# Altium project XC7A35.PrjPcb (part 4 of 5)

## Sheet SERIALIZER.SchDoc: XC7A3G-SERIALIZER
size A4; Date: 9 AUG 2026; Engineer: Parsa Malekpour; Revision: 1.0.0; SheetNumber: 15; SheetTotal: 18
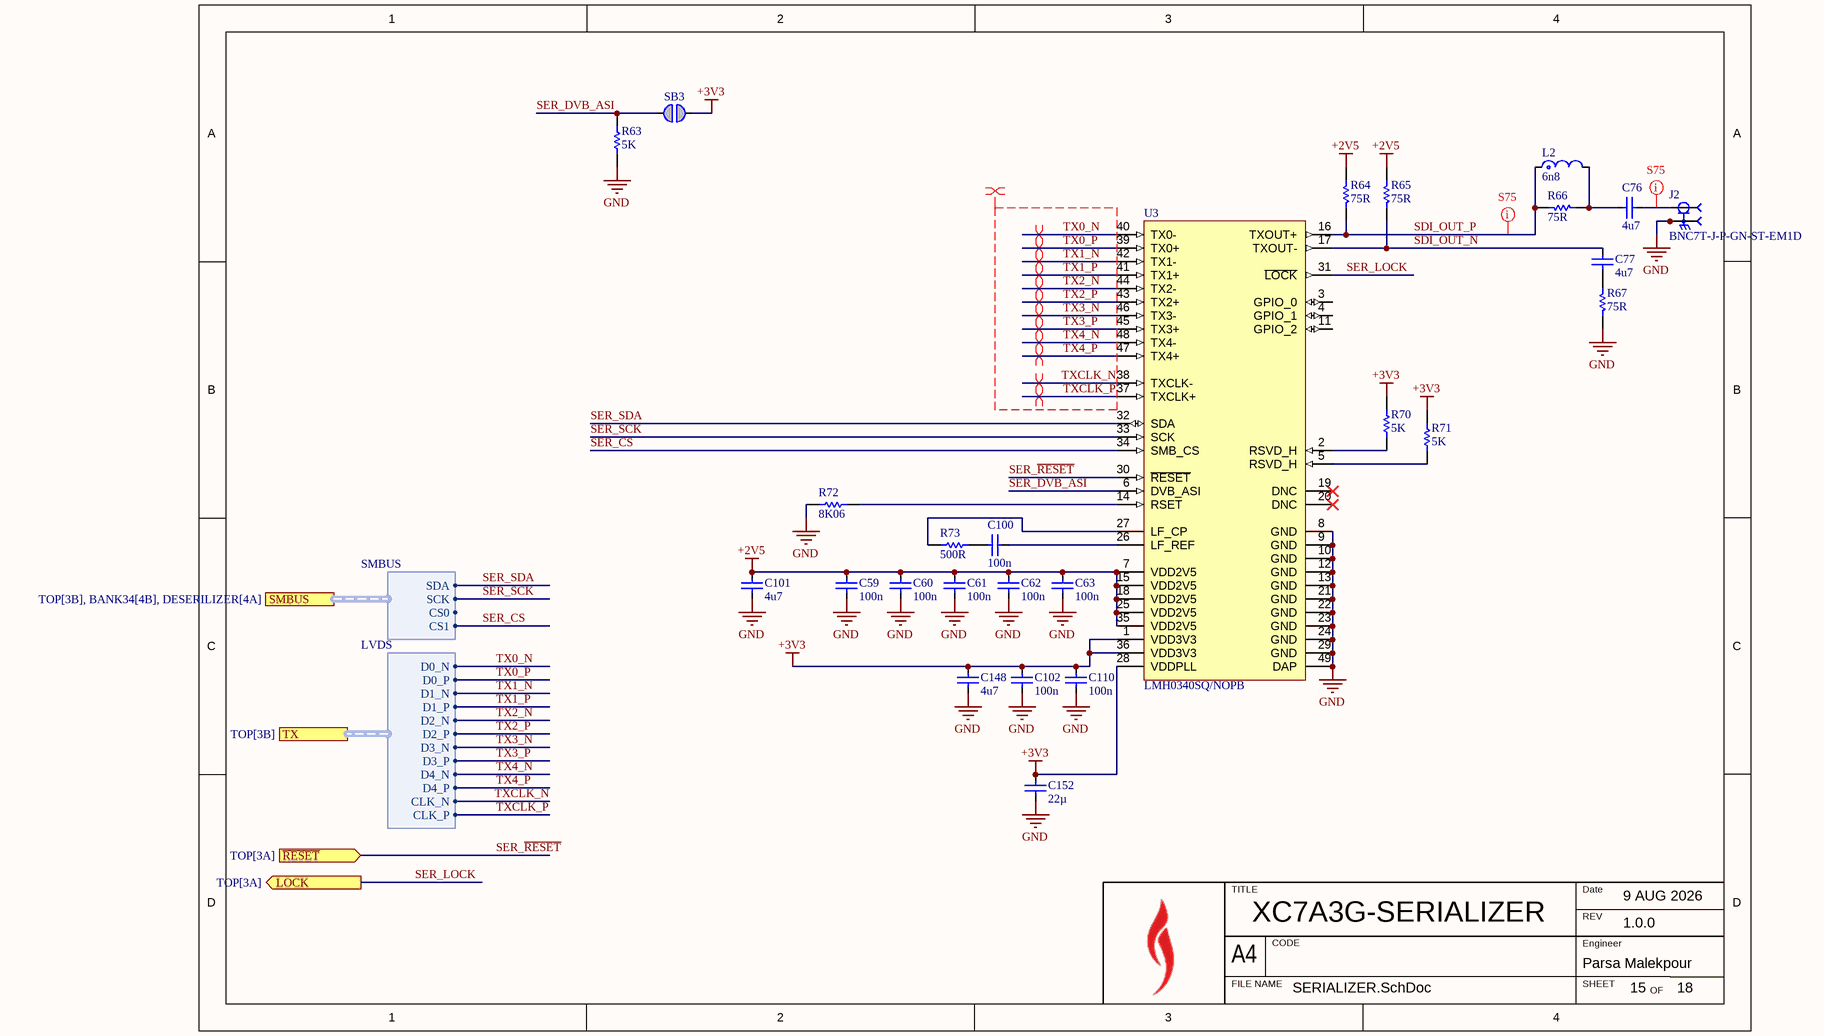
[diagram p10: SERIALIZER.SchDoc]

### Parts
C59  value 100n  [FP-C1005-050-0_05-IPC_C]  (hidden comment: C1005X7R1H104K050BB)
C60  value 100n  [FP-C1005-050-0_05-IPC_C]  (hidden comment: C1005X7R1H104K050BB)
C61  value 100n  [FP-C1005-050-0_05-IPC_C]  (hidden comment: C1005X7R1H104K050BB)
C62  value 100n  [FP-C1005-050-0_05-IPC_C]  (hidden comment: C1005X7R1H104K050BB)
C63  value 100n  [FP-C1005-050-0_05-IPC_C]  (hidden comment: C1005X7R1H104K050BB)
C76  value 4u7  [FP-C1005-050-0_20-0_10-IPC_C]  (hidden comment: C1005X5R1A475K050BE)
C77  value 4u7  [FP-C1005-050-0_20-0_10-IPC_C]  (hidden comment: C1005X5R1A475K050BE)
C100  value 100n  [FP-C1005-050-0_05-IPC_C]  (hidden comment: C1005X7R1H104K050BB)
C101  value 4u7  [FP-C1005-050-0_20-0_10-IPC_C]  (hidden comment: C1005X5R1A475K050BE)
C102  value 100n  [FP-C1005-050-0_05-IPC_C]  (hidden comment: C1005X7R1H104K050BB)
C110  value 100n  [FP-C1005-050-0_05-IPC_C]  (hidden comment: C1005X7R1H104K050BB)
C148  value 4u7  [FP-C1005-050-0_20-0_10-IPC_C]  (hidden comment: C1005X5R1A475K050BE)
C152  value 22µ  [CAPC1608X100X20LL10]  (hidden comment: C1608X5R0J226M080AC)
J2  BNC7T-J-P-GN-ST-EM1D  [SAMTEC_BNC7T-J-P-XX-ST-EM1D]
L2  value 6n8  [FP-LQP03TG_02-MFG]  (hidden comment: LQP03TN6N8J02D)
R63  value 5K  [RESC1005X40X25NL05T10]  (hidden comment: RC0402FR-075KL)
R64  value 75R  [RESC1005X40X25LL05T10]  (hidden comment: RC0402FR-0775RL)
R65  value 75R  [RESC1005X40X25LL05T10]  (hidden comment: RC0402FR-0775RL)
R66  value 75R  [RESC1005X40X25LL05T10]  (hidden comment: RC0402FR-0775RL)
R67  value 75R  [RESC1005X40X25LL05T10]  (hidden comment: RC0402FR-0775RL)
R70  value 5K  [RESC1005X40X25NL05T10]  (hidden comment: RC0402FR-075KL)
R71  value 5K  [RESC1005X40X25NL05T10]  (hidden comment: RC0402FR-075KL)
R72  value 8K06  [RESC1005X40X25LL05T10]  (hidden comment: RC0402FR-078K06L)
R73  value 500R  [RESC1005X40X25NL05T10]  (hidden comment: RT0402FRE07500RL)
SB3  Solderbridge  [Solderbridge]  (value not drawn)  (no BOM)
U3  LMH0340SQ/NOPB  [RHS0048A_V]

### Ports
LOCK (out, see TOP[3A]), SMBUS (harness SMBUS, see TOP[3B], BANK34[4B], DESERILIZER[4A]), TX (harness LVDS, see TOP[3B]), ~{RESET} (in, see TOP[3A])

### Harnesses
LVDS: D0_N, D0_P, D1_N, D1_P, D2_N, D2_P, D3_N, D3_P, D4_N, D4_P, CLK_N, CLK_P
SMBUS: SDA, SCK, CS0, CS1

### Nets
+2V5: C59.1 C60.1 C61.1 C62.1 C63.1 C101.2 R64.2 R65.2 U3.7(VDD2V5) U3.15(VDD2V5) U3.18(VDD2V5) U3.25(VDD2V5) U3.35(VDD2V5)
+3V3: C102.1 C110.1 C148.1 C152.1 R70.1 R71.1 SB3.1 U3.1(VDD3V3) U3.28(VDDPLL) U3.36(VDD3V3)
GND: C59.2 C60.2 C61.2 C62.2 C63.2 C101.1 C102.2 C110.2 C148.2 C152.2 J2.S1 J2.S2 J2.S3 J2.S4 R63.2 R67.2 R72.1 U3.8(GND) U3.9(GND) U3.10(GND) U3.12(GND) U3.13(GND) U3.21(GND) U3.22(GND) U3.23(GND) U3.24(GND) U3.29(GND) U3.49(DAP)
SDI_OUT_N: C77.2 R65.1 U3.17(TXOUT-)
SDI_OUT_P: L2.1 R64.1 R66.1 U3.16(TXOUT+)
SER_CS: U3.34(SMB_CS) ; port SMBUS.CS1
SER_DVB_ASI: R63.1 SB3.2 U3.6(DVB_ASI)
SER_LOCK: U3.31(~{LOCK}) ; port LOCK
SER_~{RESET}: U3.30(~{RESET}) ; port ~{RESET}
SER_SCK: U3.33(SCK) ; port SMBUS.SCK  [project net DES_SCK]
SER_SDA: U3.32(SDA) ; port SMBUS.SDA  [project net DES_SDA]
TX0_N: U3.40(TX0-) ; port TX.D0_N  [project net B34_L10_N]
TX0_P: U3.39(TX0+) ; port TX.D0_P  [project net B34_L10_P]
TX1_N: U3.42(TX1-) ; port TX.D1_N  [project net B34_L12_N]
TX1_P: U3.41(TX1+) ; port TX.D1_P  [project net B34_L12_P]
TX2_N: U3.44(TX2-) ; port TX.D2_N  [project net B34_L8_N]
TX2_P: U3.43(TX2+) ; port TX.D2_P  [project net B34_L8_P]
TX3_N: U3.46(TX3-) ; port TX.D3_N  [project net B34_L11_N]
TX3_P: U3.45(TX3+) ; port TX.D3_P  [project net B34_L11_P]
TX4_N: U3.48(TX4-) ; port TX.D4_N  [project net B34_L7_N]
TX4_P: U3.47(TX4+) ; port TX.D4_P  [project net B34_L7_P]
TXCLK_N: U3.38(TXCLK-) ; port TX.CLK_N  [project net B34_L9_N]
TXCLK_P: U3.37(TXCLK+) ; port TX.CLK_P  [project net B34_L9_P]
NetC76_1: C76.1 L2.2 R66.2
NetC76_2: C76.2 J2.1
NetC77_1: C77.1 R67.1
NetC100_1: C100.1 R73.2
NetC100_2: C100.2 U3.26(LF_REF)
NetR70_2: R70.2 U3.2(RSVD_H)
NetR71_2: R71.2 U3.5(RSVD_H)
NetR72_2: R72.2 U3.14(RSET)
NetR73_1: R73.1 U3.27(LF_CP)

Not connected (* = marked no-connect by the designer): U3 3(GPIO_0) 4(GPIO_1) 11(GPIO_2) 19(DNC)* 20(DNC)*

### Layout directives
differential pair: B34_L7_N, B34_L7_P, B34_L8_N, B34_L8_P, B34_L9_N, B34_L9_P, B34_L10_N, B34_L10_P, B34_L11_N, B34_L11_P, B34_L12_N, B34_L12_P
net class LVDS_TX: TX0_N, TX0_P, TX1_N, TX1_P, TX2_N, TX2_P, TX3_N, TX3_P, TX4_N, TX4_P, TXCLK_N, TXCLK_P
rule Impedance Constraint [Min = 70.00    Max = 80.00    ]: NetC76_2, SDI_OUT_P

### Notes on the sheet
- TITLE
- REV
- Date
- A4
- FILE NAME
- CODE
- SHEET
- Engineer
- OF

### Library data of the parts
C59-C63 C100 C102 C110 = C1005X7R1H104K050BB: MLCC 100nF ±10% 50V X7R SMD 0402; Dielectric Material: Ceramic; Voltage: 50V; Min Operating Temperature: -55°C; Depth: 0.5mm; Radiation Hardening: No; RoHS Compliant: Yes; Voltage Rating (DC): 50V; Lead Free: Lead Free; Resistor Type: Ceramic; Height: 0.5mm; Dielectric: X7R; Thickness: 0.022inch; Case/Package: 0402; Case Code (Metric): 1005; Termination: SMD/SMT; Packaging: Tape and Reel; Max Operating Temperature: 125°C; Mount: Surface Mount; Package Quantity: 1; Width: 0.02inch; Weight: 2.3E-05oz; Voltage Rating: 50V; Tolerance: 10%; Construction: Flat; Case Code (Imperial): 0402; Length: 1mm; REACH SVHC: No SVHC; Series: C; Part Number: C1005X7R1H104K050BB
C76 C77 C101 C148 = C1005X5R1A475K050BE: 4.7UF 10V X5R 0402; Tolerance: 10%; Max Operating Temperature: 85°C; Case Code (Metric): 1005; Voltage Rating: 10V; Packaging: Tape and Reel; Case/Package: 0402; Features: Soft Termination; Min Operating Temperature: -55°C; Mount: Surface Mount; Case Code (Imperial): 0402; RoHS Compliant: Yes; Part Number: C1005X5R1A475K050BE
C152 = C1608X5R0J226M080AC: MLCC 22 uF, ±20%, 6.3 V, -55 to 85 degC, 1608 (0603 Metric), RoHS, Tape and Reel; PCN Part Number: MLCCPartNumberChange30/Nov/2012; Manufacturer: TDK; Temperature Coefficient: X5R; Product Training Modules: CSeriesGeneralApplicationsSEAT,CCV,andTVCLDesignToolsGuidetoReplacinganElectrolyticCapacitorwithanMLCC; Other Names: 445-8028-1; Voltage - Rated: 6.3V; Design Resources: 20WNon-IsolatedBuckLEDDriverUsingPLLNK460KG; Online Catalog: CSeries,GeneralPurpose; Kits: 445-9003-KIT-ND-KITCAPCERHICAPMLCCSMD; Tolerance: ±20%; Series: C; Thickness (Max): 0.039"(1.00mm); Mounting Type: SurfaceMount,MLCC; Ratings: -; Datasheet Version: Mar-15; Package Reference: 603; Packaging: CutTape(CT); Features: -; Package / Case: 0603(1608Metric); Family: CeramicCapacitors; Lead Spacing: -; RoHS Information: RoHSCertificate-MLCC; Manufacturer URL: http://www.tdk.com/; Lead Style: -; Category: Capacitors; Applications: GeneralPurpose; Package Description: 2-Pin Surface Mount Device, Body 1.6 x 0.8 mm; Standard Package: 1; Datasheet URL: http://www.farnell.com/datasheets/1913358.pdf; Height - Seated (Max): -; Operating Temperature: -55degC~85degC; Size / Dimension: 0.063"Lx0.031"W(1.60mmx0.80mm)
J2 = BNC7T-J-P-GN-ST-EM1D: BNC Connector Jack, Female Socket 75Ohm Board Edge, End Launch; Panel Mount Solder; MF: Samtec Inc.; Package: None; MP: BNC7T-J-P-GN-ST-EM1D; DigiKey-Purchase-URL: https://snapeda.com/shop?store=DigiKey&id=3266999; Price: None; SnapEDA_Link: https://www.snapeda.com/parts/BNC7T-J-P-GN-ST-EM1D/Samtec%20Inc./view-part/3266999/?ref=snap; Toby_UK-Purchase-URL: https://snapeda.com/shop?store=Toby+UK&id=3266999; Value: *; Availability: Unavailable; Supplier 1: DigiKey; Supplier Part Number 1: SAM10916-ND
L2 = LQP03TN6N8J02D: Film type RF Inductor 6.8nH ±5% 300mA 0.6Ω 0201 (0603); DC Resistance (DCR): 600mR; Q Factor: 14; Shielding: Unshielded; Self Resonant Frequency: 3.9GHz; Core Material: Non-Magnetic; Test Frequency: 500MHz; Mount: Surface Mount; Case Code (Metric): 0603; Depth: 0.33mm; DC Current: 300mA; Current Rating: 300mA; Height: 0.3mm; Min Operating Temperature: -55°C; Width: 0.012inch; Height - Seated (Max): 0.013inch; Package Quantity: 15000; Max DC Current: 300mA; Radiation Hardening: No; Resistor Type: Thin Film; Packaging: Tape and Reel; Length: 0.024inch; Case Code (Imperial): 0201; Weight: 6E-06oz; Military Standard: Not; Case/Package: 0201; Termination: SMD/SMT; Max Operating Temperature: 125°C; Tolerance: 5%
R63 R70 R71 = RES: 62.5mW Thick Film Resistors 50V ±100ppm/℃ ±1% 5kΩ 0402 Chip Resistor - Surface Mount ROHS; Manufacturer: Yageo / Phycomp; Manufacturer Part Number: RC0402FR-071KL; Power Rating: 63mW; Temperature Coefficient: 100ppm/°C; Part Number: RC0402FR-075KL; Supplier: Farnell; Supplier Part Number: 2421889; RoHS: Compliant; Category: Chip SMD Resistors; Stock: 6760000; Pricing: 10000=0.464, 50000=0.406, 100000=0.336 (JPY); Case/Package: 0402; Case Code (Imperial): 0402; Case Code (Metric): 0402; China RoHS: Non-Compliant; Composition: Thick Film; Depth: 500µm; Height: 350µm; Lead Free: Lead Free; Length: 1mm; Lifecycle Status: Production; Max Operating Temperature: 155°C; Military Standard: Not; Min Operating Temperature: -55°C; Mounting Technology: Surface Mount; Pins: 2; Number of Terminals: 2; Packaging: Tape & Reel; Power Dissipation: 62.5mW; REACH SVHC: Yes; Schedule B: 8533210045, 8533210045|8533210045|8533210045|8533210045|8533210045|8533210045|8533210045|8533210045|8533210045|8533210045|8533210045|8533210045|8533210045|8533210045|8533210045|8533210045|8533210045|8533210045|8533210045|8533210045|8533210045|8533210045|8533210045|85; Termination: SMD/SMT; Tolerance: 1%; Voltage Rating: 50V; Voltage Rating (AC): 50V; Voltage Rating (DC): 50V; Width: 500µm; Working Voltage: 50V; ComponentLink1URL: https://datasheet.octopart.com:443/RC0402FR-071KL-Yageo-datasheet-175887523.pdf?src-supplier=IHS; ComponentLink1Description: https://datasheet.octopart.com:443/RC0402FR-071KL-Yageo-datasheet-175887523.pdf?src-supplier=IHS; ComponentLink2URL: https://datasheet.octopart.com:443/RC0402FR-071KL-Yageo-datasheet-164759695.pdf?src-supplier=Upverter; ComponentLink2Description: https://datasheet.octopart.com:443/RC0402FR-071KL-Yageo-datasheet-164759695.pdf?src-supplier=Upverter; ComponentLink3URL: https://datasheet.octopart.com:443/RC0402FR-071KL-Yageo-datasheet-103092701.pdf?src-supplier=Upverter; ComponentLink3Description: https://datasheet.octopart.com:443/RC0402FR-071KL-Yageo-datasheet-103092701.pdf?src-supplier=Upverter; ComponentLink4URL: https://sigma.octopart.com:443/138820526/technical_drawing/Yageo-RC0402FR-071KL.pdf?src-supplier=Upverter; ComponentLink4Description: https://sigma.octopart.com:443/138820526/technical_drawing/Yageo-RC0402FR-071KL.pdf?src-supplier=Upverter; ComponentLink5URL: https://datasheet.octopart.com:443/RC0402FR-071KL-Yageo-datasheet-98239111.pdf?src-supplier=Upverter; ComponentLink5Description: https://datasheet.octopart.com:443/RC0402FR-071KL-Yageo-datasheet-98239111.pdf?src-supplier=Upverter; ComponentLink6URL: https://datasheet.octopart.com:443/RC0402FR-071KL-Yageo-Group-datasheet-190305687.pdf?src-supplier=Future+Electronics; ComponentLink6Description: https://datasheet.octopart.com:443/RC0402FR-071KL-Yageo-Group-datasheet-190305687.pdf?src-supplier=Future+Electronics; ComponentLink7URL: https://datasheet.octopart.com:443/RC0402FR-071KL-Yageo-datasheet-12531192.pdf?src-supplier=Future+Electronics; ComponentLink7Description: https://datasheet.octopart.com:443/RC0402FR-071KL-Yageo-datasheet-12531192.pdf?src-supplier=Future+Electronics; ComponentLink8URL: https://datasheet.octopart.com:443/RC0402FR-071KL-Yageo-datasheet-137700087.pdf?src-supplier=Future+Electronics; ComponentLink8Description: https://datasheet.octopart.com:443/RC0402FR-071KL-Yageo-datasheet-137700087.pdf?src-supplier=Future+Electronics; ComponentLink9URL: https://datasheet.octopart.com:443/RC0402FR-071KL-Yageo-datasheet-8324255.pdf?src-supplier=Future+Electronics; ComponentLink9Description: https://datasheet.octopart.com:443/RC0402FR-071KL-Yageo-datasheet-8324255.pdf?src-supplier=Future+Electronics; ComponentLink10URL: https://datasheet.octopart.com:443/RC0402FR-071KL-Yageo-datasheet-10408619.pdf?src-supplier=Newark; ComponentLink10Description: https://datasheet.octopart.com:443/RC0402FR-071KL-Yageo-datasheet-10408619.pdf?src-supplier=Newark; ComponentLink11URL: https://datasheet.octopart.com:443/RC0402FR-071KL-Yageo-datasheet-8324527.pdf?src-supplier=Newark; ComponentLink11Description: https://datasheet.octopart.com:443/RC0402FR-071KL-Yageo-datasheet-8324527.pdf?src-supplier=Newark; ComponentLink12URL: https://datasheet.octopart.com:443/RC0402FR-071KL-Yageo-datasheet-62067350.pdf?src-supplier=Farnell; ComponentLink12Description: https://datasheet.octopart.com:443/RC0402FR-071KL-Yageo-datasheet-62067350.pdf?src-supplier=Farnell; ComponentLink13URL: https://datasheet.octopart.com:443/RC0402FR-071KL-Yageo-datasheet-8329306.pdf?src-supplier=element14; ComponentLink13Description: https://datasheet.octopart.com:443/RC0402FR-071KL-Yageo-datasheet-8329306.pdf?src-supplier=element14; ComponentLink14URL: https://datasheet.octopart.com:443/RC0402FR-071KL-Yageo-datasheet-505231.pdf?src-supplier=element14; ComponentLink14Description: https://datasheet.octopart.com:443/RC0402FR-071KL-Yageo-datasheet-505231.pdf?src-supplier=element14; ComponentLink15URL: https://datasheet.octopart.com:443/RC0402FR-071KL-Yageo-datasheet-175423674.pdf?src-supplier=SOS+electronic; ComponentLink15Description: https://datasheet.octopart.com:443/RC0402FR-071KL-Yageo-datasheet-175423674.pdf?src-supplier=SOS+electronic; ComponentLink16URL: https://datasheet.octopart.com:443/RC0402FR-071KL-Yageo-datasheet-148775077.pdf?src-supplier=TME; ComponentLink16Description: https://datasheet.octopart.com:443/RC0402FR-071KL-Yageo-datasheet-148775077.pdf?src-supplier=TME; ComponentLink17URL: https://datasheet.octopart.com:443/RC0402FR-071KL-Yageo-datasheet-79472498.pdf?src-supplier=Megastar; ComponentLink17Description: https://datasheet.octopart.com:443/RC0402FR-071KL-Yageo-datasheet-79472498.pdf?src-supplier=Megastar; ComponentLink18URL: https://datasheet.octopart.com/RC0402FR-071KL-Yageo-datasheet-73766026.pdf; ComponentLink18Description: https://datasheet.octopart.com/RC0402FR-071KL-Yageo-datasheet-73766026.pdf; ComponentLink19URL: http://sigma.octopart.com:80/conflict_mineral_statement/Yageo-company-3.pdf?src-supplier=Compliance+Statements; ComponentLink19Description: http://sigma.octopart.com:80/conflict_mineral_statement/Yageo-company-3.pdf?src-supplier=Compliance+Statements; ComponentLink20URL: http://sigma.octopart.com:80/rohs_statement/Yageo-company-2.pdf?src-supplier=Compliance+Statements; ComponentLink20Description: http://sigma.octopart.com:80/rohs_statement/Yageo-company-2.pdf?src-supplier=Compliance+Statements; Supplier 1: Farnell; Supplier Part Number 1: 2421889
R64-R67 = RC0402FR-0775RL: Manufacturer: Yageo / Phycomp; Part Number: RC0402FR-0775RL
R72 = RC0402FR-078K06L: Manufacturer: Yageo / Phycomp; Part Number: RC0402FR-078K06L
R73 = RT0402FRE07500RL: Res, 500R, 1%, 0.063W, Thin Film, 0402 Rohs Compliant: Yes; Manufacturer: Yageo / Phycomp; Manufacturer Part Number: RC0402FR-071KL; Power Dissipation: 62.5mW; Power Rating: 63mW; Temperature Coefficient: 100ppm/°C; Voltage Rating: 50V; Part Number: RT0402FRE07500RL; Supplier: Farnell; Supplier Part Number: 2421889; RoHS: Compliant; Category: Chip SMD Resistors; Stock: 6760000; Pricing: 10000=0.464, 50000=0.406, 100000=0.336 (JPY); Case/Package: 0402; Case Code (Imperial): 0402; Case Code (Metric): 0402; China RoHS: Non-Compliant; Composition: Thick Film; Depth: 500µm; Height: 350µm; Lead Free: Lead Free; Length: 1mm; Lifecycle Status: Production; Max Operating Temperature: 155°C; Military Standard: Not; Min Operating Temperature: -55°C; Mounting Technology: Surface Mount; Pins: 2; Number of Terminals: 2; Packaging: Tape & Reel; REACH SVHC: Yes; Schedule B: 8533210045, 8533210045|8533210045|8533210045|8533210045|8533210045|8533210045|8533210045|8533210045|8533210045|8533210045|8533210045|8533210045|8533210045|8533210045|8533210045|8533210045|8533210045|8533210045|8533210045|8533210045|8533210045|8533210045|8533210045|85; Termination: SMD/SMT; Tolerance: 1%; Voltage Rating (AC): 50V; Voltage Rating (DC): 50V; Width: 500µm; Working Voltage: 50V; ComponentLink1URL: https://datasheet.octopart.com:443/RC0402FR-071KL-Yageo-datasheet-175887523.pdf?src-supplier=IHS; ComponentLink1Description: https://datasheet.octopart.com:443/RC0402FR-071KL-Yageo-datasheet-175887523.pdf?src-supplier=IHS; ComponentLink2URL: https://datasheet.octopart.com:443/RC0402FR-071KL-Yageo-datasheet-164759695.pdf?src-supplier=Upverter; ComponentLink2Description: https://datasheet.octopart.com:443/RC0402FR-071KL-Yageo-datasheet-164759695.pdf?src-supplier=Upverter; ComponentLink3URL: https://datasheet.octopart.com:443/RC0402FR-071KL-Yageo-datasheet-103092701.pdf?src-supplier=Upverter; ComponentLink3Description: https://datasheet.octopart.com:443/RC0402FR-071KL-Yageo-datasheet-103092701.pdf?src-supplier=Upverter; ComponentLink4URL: https://sigma.octopart.com:443/138820526/technical_drawing/Yageo-RC0402FR-071KL.pdf?src-supplier=Upverter; ComponentLink4Description: https://sigma.octopart.com:443/138820526/technical_drawing/Yageo-RC0402FR-071KL.pdf?src-supplier=Upverter; ComponentLink5URL: https://datasheet.octopart.com:443/RC0402FR-071KL-Yageo-datasheet-98239111.pdf?src-supplier=Upverter; ComponentLink5Description: https://datasheet.octopart.com:443/RC0402FR-071KL-Yageo-datasheet-98239111.pdf?src-supplier=Upverter; ComponentLink6URL: https://datasheet.octopart.com:443/RC0402FR-071KL-Yageo-Group-datasheet-190305687.pdf?src-supplier=Future+Electronics; ComponentLink6Description: https://datasheet.octopart.com:443/RC0402FR-071KL-Yageo-Group-datasheet-190305687.pdf?src-supplier=Future+Electronics; ComponentLink7URL: https://datasheet.octopart.com:443/RC0402FR-071KL-Yageo-datasheet-12531192.pdf?src-supplier=Future+Electronics; ComponentLink7Description: https://datasheet.octopart.com:443/RC0402FR-071KL-Yageo-datasheet-12531192.pdf?src-supplier=Future+Electronics; ComponentLink8URL: https://datasheet.octopart.com:443/RC0402FR-071KL-Yageo-datasheet-137700087.pdf?src-supplier=Future+Electronics; ComponentLink8Description: https://datasheet.octopart.com:443/RC0402FR-071KL-Yageo-datasheet-137700087.pdf?src-supplier=Future+Electronics; ComponentLink9URL: https://datasheet.octopart.com:443/RC0402FR-071KL-Yageo-datasheet-8324255.pdf?src-supplier=Future+Electronics; ComponentLink9Description: https://datasheet.octopart.com:443/RC0402FR-071KL-Yageo-datasheet-8324255.pdf?src-supplier=Future+Electronics; ComponentLink10URL: https://datasheet.octopart.com:443/RC0402FR-071KL-Yageo-datasheet-10408619.pdf?src-supplier=Newark; ComponentLink10Description: https://datasheet.octopart.com:443/RC0402FR-071KL-Yageo-datasheet-10408619.pdf?src-supplier=Newark; ComponentLink11URL: https://datasheet.octopart.com:443/RC0402FR-071KL-Yageo-datasheet-8324527.pdf?src-supplier=Newark; ComponentLink11Description: https://datasheet.octopart.com:443/RC0402FR-071KL-Yageo-datasheet-8324527.pdf?src-supplier=Newark; ComponentLink12URL: https://datasheet.octopart.com:443/RC0402FR-071KL-Yageo-datasheet-62067350.pdf?src-supplier=Farnell; ComponentLink12Description: https://datasheet.octopart.com:443/RC0402FR-071KL-Yageo-datasheet-62067350.pdf?src-supplier=Farnell; ComponentLink13URL: https://datasheet.octopart.com:443/RC0402FR-071KL-Yageo-datasheet-8329306.pdf?src-supplier=element14; ComponentLink13Description: https://datasheet.octopart.com:443/RC0402FR-071KL-Yageo-datasheet-8329306.pdf?src-supplier=element14; ComponentLink14URL: https://datasheet.octopart.com:443/RC0402FR-071KL-Yageo-datasheet-505231.pdf?src-supplier=element14; ComponentLink14Description: https://datasheet.octopart.com:443/RC0402FR-071KL-Yageo-datasheet-505231.pdf?src-supplier=element14; ComponentLink15URL: https://datasheet.octopart.com:443/RC0402FR-071KL-Yageo-datasheet-175423674.pdf?src-supplier=SOS+electronic; ComponentLink15Description: https://datasheet.octopart.com:443/RC0402FR-071KL-Yageo-datasheet-175423674.pdf?src-supplier=SOS+electronic; ComponentLink16URL: https://datasheet.octopart.com:443/RC0402FR-071KL-Yageo-datasheet-148775077.pdf?src-supplier=TME; ComponentLink16Description: https://datasheet.octopart.com:443/RC0402FR-071KL-Yageo-datasheet-148775077.pdf?src-supplier=TME; ComponentLink17URL: https://datasheet.octopart.com:443/RC0402FR-071KL-Yageo-datasheet-79472498.pdf?src-supplier=Megastar; ComponentLink17Description: https://datasheet.octopart.com:443/RC0402FR-071KL-Yageo-datasheet-79472498.pdf?src-supplier=Megastar; ComponentLink18URL: https://datasheet.octopart.com/RC0402FR-071KL-Yageo-datasheet-73766026.pdf; ComponentLink18Description: https://datasheet.octopart.com/RC0402FR-071KL-Yageo-datasheet-73766026.pdf; ComponentLink19URL: http://sigma.octopart.com:80/conflict_mineral_statement/Yageo-company-3.pdf?src-supplier=Compliance+Statements; ComponentLink19Description: http://sigma.octopart.com:80/conflict_mineral_statement/Yageo-company-3.pdf?src-supplier=Compliance+Statements; ComponentLink20URL: http://sigma.octopart.com:80/rohs_statement/Yageo-company-2.pdf?src-supplier=Compliance+Statements; ComponentLink20Description: http://sigma.octopart.com:80/rohs_statement/Yageo-company-2.pdf?src-supplier=Compliance+Statements; Supplier 1: DigiKey; Supplier Part Number 1: 13-RT0402FRE07500RLCT-ND
SB3 = Solderbridge_1: Manufacturer: N.A.; Pad Count: 2; Part Number: Solderbridge; Manufacturer Part Number: N.A.; LatestRevisionDate: 2009-12-14; Published: 2009-12-14; Value: Solderbridge; Note: N.A.; Artikkelnr Noca: N.A.; Footprint Doc: Solderbridge; Part number IPS: N.A.; ComponentLink1URL: N.A.; ComponentLink1Description: Datasheet; ComponentLink2URL: N.A.; ComponentLink2Description: Supplier link; HelpURL: N.A.; Supplier 1: N.A.; Supplier Part Number 1: N.A.; Supplier 2: N.A.; Supplier Part Number 2: N.A.; Component Class: Connectors; PartId: 100500458
U3 = CMP-0058-00394-3: 3 Gbps, HD, SD, DVB-ASI SDI Serializer and Driver with LVDS Interface, 48-pin LLP, Pb-Free; Manufacturer: Texas Instruments; CompType: Interface IC; PackageTopMarking: NS*UZXYTTE#*L0340; PowerWise: N; Code_JEDEC: MO-220-WKKD-2; PackageReference: RHS0048A; PackageDescription: LLP, Plastic, Quad, 7 x 7 x 0.8mm Body, 48 Lead, 0.5mm Pitch, No Pullback; ComponentLink1Description: Datasheet URL; ComponentLink1URL: http://www.ti.com/general/docs/lit/getliterature.tsp?genericPartNumber=LMH0340&fileType=pdf; PinCount: 48; RoHS: Y; Supplier 1: Arrow Electronics; Supplier Part Number 1: LMH0340SQ/NOPB

## Sheet OPTICS.SchDoc: XC7A3G-SFP
size A; Date: 9 AUG 2026; Engineer: Parsa Malekpour; Revision: 1.0.0; SheetNumber: 14; SheetTotal: 18
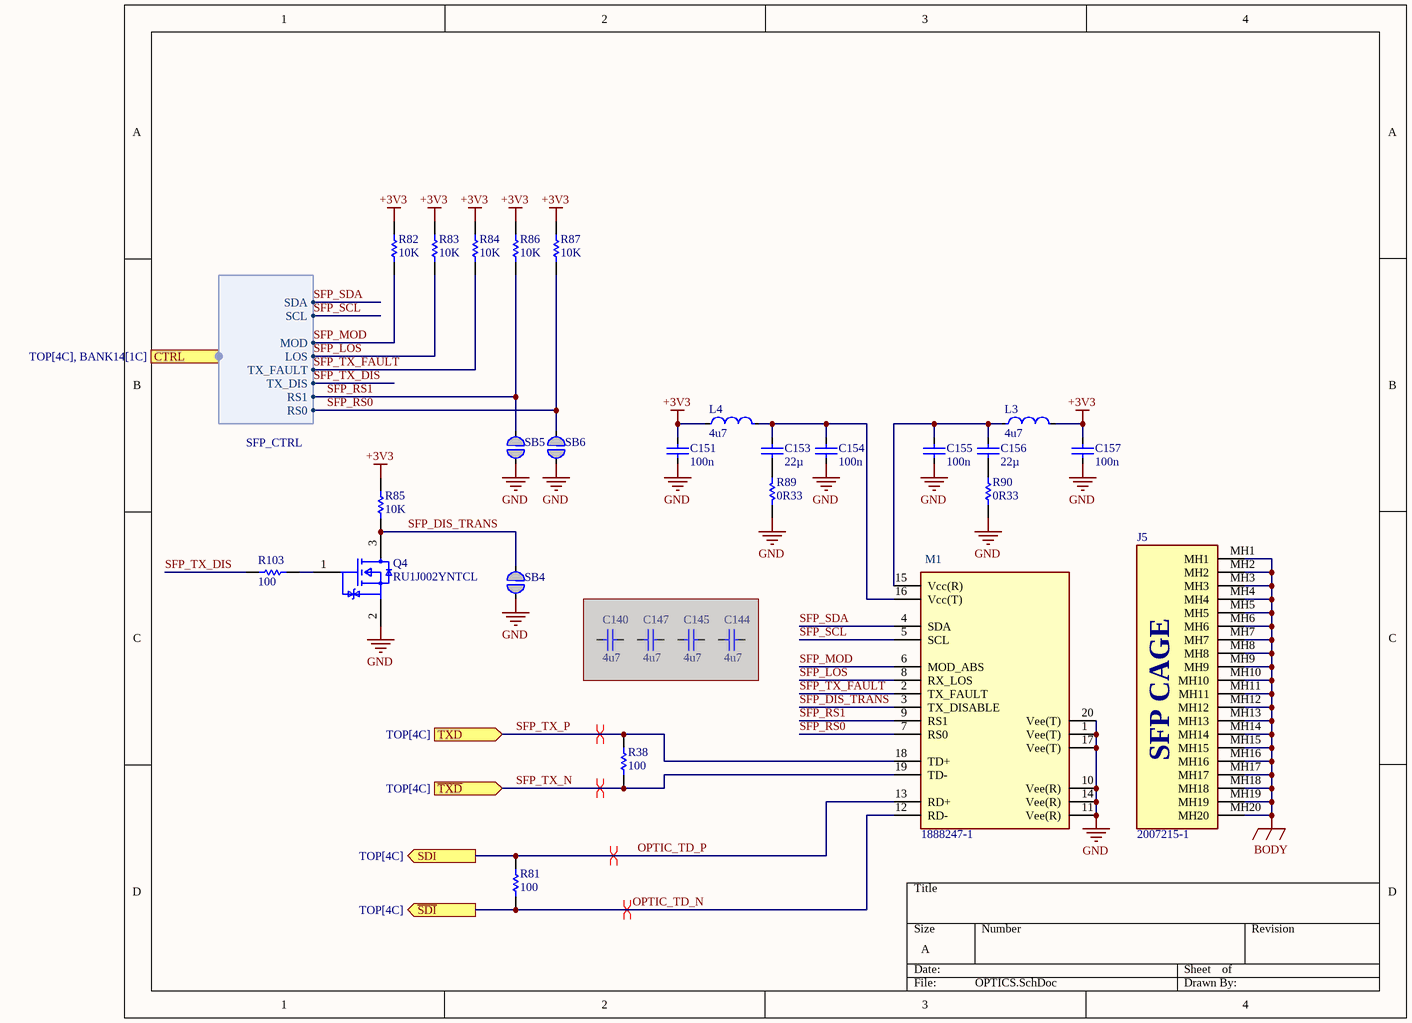
[diagram p11: OPTICS.SchDoc]

### Parts
C140  value 4u7  [FP-C1005-050-0_20-0_10-MFG]  (hidden comment: C1005X5R1A475K050BE)  (masked out: inside a compile mask, not in the netlist)
C144  value 4u7  [FP-C1005-050-0_20-0_10-MFG]  (hidden comment: C1005X5R1A475K050BE)  (masked out: inside a compile mask, not in the netlist)
C145  value 4u7  [FP-C1005-050-0_20-0_10-MFG]  (hidden comment: C1005X5R1A475K050BE)  (masked out: inside a compile mask, not in the netlist)
C147  value 4u7  [FP-C1005-050-0_20-0_10-MFG]  (hidden comment: C1005X5R1A475K050BE)  (masked out: inside a compile mask, not in the netlist)
C151  value 100n  [FP-C1005-050-0_05-IPC_C]  (hidden comment: C1005X7R1H104K050BB)
C153  value 22µ  [CAPC1608X100X20LL10]  (hidden comment: C1608X5R0J226M080AC)
C154  value 100n  [FP-C1005-050-0_05-IPC_C]  (hidden comment: C1005X7R1H104K050BB)
C155  value 100n  [FP-C1005-050-0_05-IPC_C]  (hidden comment: C1005X7R1H104K050BB)
C156  value 22µ  [CAPC1608X100X20LL10]  (hidden comment: C1608X5R0J226M080AC)
C157  value 100n  [FP-C1005-050-0_05-IPC_C]  (hidden comment: C1005X7R1H104K050BB)
J5  2007215-1  [2007215-1]
L3  value 4u7  [FP-DFE252012C-MFG]  (hidden comment: DFE252012P-4R7M=P2)
L4  value 4u7  [FP-DFE252012C-MFG]  (hidden comment: DFE252012P-4R7M=P2)
M1  1888247-1  [1888247-1]
Q4  RU1J002YNTCL  [FP-UMT3F-MFG]
R38  value 100  [RESC1005X40X25LL05T10]  (hidden comment: RC0402FR-07100RL)
R81  value 100  [RESC1005X40X25LL05T10]  (hidden comment: RC0402FR-07100RL)
R82  value 10K  [RESC1005X40X25LL05T10]  (hidden comment: RC0402FR-0710KL)
R83  value 10K  [RESC1005X40X25LL05T10]  (hidden comment: RC0402FR-0710KL)
R84  value 10K  [RESC1005X40X25LL05T10]  (hidden comment: RC0402FR-0710KL)
R85  value 10K  [RESC1005X40X25LL05T10]  (hidden comment: RC0402FR-0710KL)
R86  value 10K  [RESC1005X40X25LL05T10]  (hidden comment: RC0402FR-0710KL)
R87  value 10K  [RESC1005X40X25LL05T10]  (hidden comment: RC0402FR-0710KL)
R89  value 0R33  [RESC1608X55X30LL15T15]  (hidden comment: ERJ-3RQFR33V)
R90  value 0R33  [RESC1608X55X30LL15T15]  (hidden comment: ERJ-3RQFR33V)
R103  value 100  [RESC1005X40X25LL05T10]  (hidden comment: RC0402FR-07100RL)
SB4  Solderbridge  [Solderbridge]  (value not drawn)  (no BOM)
SB5  Solderbridge  [Solderbridge]  (value not drawn)  (no BOM)
SB6  Solderbridge  [Solderbridge]  (value not drawn)  (no BOM)

### Ports
CTRL (harness SFP_CTRL, see TOP[4C], BANK14[1C]), SDI (out, see TOP[4C]), TXD (in, see TOP[4C]), ~{SDI} (out, see TOP[4C]), ~{TXD} (in, see TOP[4C])

### Harnesses
SFP_CTRL: RS0, RS1, TX_DIS, TX_FAULT, LOS, MOD, SCL, SDA

### Nets
+3V3: C151.2 C157.2 L3.2 L4.2 R82.1 R83.1 R84.1 R85.2 R86.1 R87.1
BODY: J5.MH1 J5.MH2 J5.MH3 J5.MH4 J5.MH5 J5.MH6 J5.MH7 J5.MH8 J5.MH9 J5.MH10 J5.MH11 J5.MH12 J5.MH13 J5.MH14 J5.MH15 J5.MH16 J5.MH17 J5.MH18 J5.MH19 J5.MH20
GND: C151.1 C154.1 C155.1 C157.1 M1.1(Vee(T)) M1.10(Vee(R)) M1.11(Vee(R)) M1.14(Vee(R)) M1.17(Vee(T)) M1.20(Vee(T)) Q4.2(S) R89.2 R90.1 SB4.2 SB5.2 SB6.2
OPTIC_TD_N: M1.12(RD-) R81.2 ; port ~{SDI}
OPTIC_TD_P: M1.13(RD+) R81.1 ; port SDI
SFP_DIS_TRANS: M1.3(TX_DISABLE) Q4.3(D) R85.1 SB4.1
SFP_LOS: M1.8(RX_LOS) R83.2 ; port CTRL.LOS
SFP_MOD: M1.6(MOD_ABS) R82.2 ; port CTRL.MOD
SFP_RS0: M1.7(RS0) R87.2 SB6.1 ; port CTRL.RS0
SFP_RS1: M1.9(RS1) R86.2 SB5.1 ; port CTRL.RS1
SFP_SCL: M1.5(SCL) ; port CTRL.SCL
SFP_SDA: M1.4(SDA) ; port CTRL.SDA  [project net SFP_SCL.SDA]
SFP_TX_DIS: R103.1 ; port CTRL.TX_DIS  [project net SFP_SCL.TX_DIS]
SFP_TX_FAULT: M1.2(TX_FAULT) R84.2 ; port CTRL.TX_FAULT  [project net SFP_SCL.TX_FAULT]
SFP_TX_N: M1.19(TD-) R38.1 ; port ~{TXD}
SFP_TX_P: M1.18(TD+) R38.2 ; port TXD
NetC153_1: C153.1 C154.2 L4.1 M1.16(Vcc(T))
NetC153_2: C153.2 R89.1
NetC155_2: C155.2 C156.1 L3.1 M1.15(Vcc(R))
NetC156_2: C156.2 R90.2
NetQ4_1: Q4.1(G) R103.2

### Layout directives
differential pair; differential pair class SDI100: OPTIC_TD_N, OPTIC_TD_P, SFP_TX_N, SFP_TX_P

### Notes on the sheet
- (near J5) SFP CAGE

### Library data of the parts
C140 C144 C145 C147 = C1005X5R1A475K050BE: MLCC  4.7UF ±20 10V X5R 0402; Tolerance: 10%; Max Operating Temperature: 85°C; Case Code (Metric): 1005; Voltage Rating: 10V; Packaging: Tape and Reel; Case/Package: 0402; Features: Soft Termination; Min Operating Temperature: -55°C; Mount: Surface Mount; Case Code (Imperial): 0402; RoHS Compliant: Yes; Part Number: C1005X5R1A475K050BE
C151 C154 C155 C157 = C1005X7R1H104K050BB: as C59-C63 on sheet SERIALIZER; Voltage: 50V; Min Operating Temperature: -55°C; Depth: 0.5mm; Radiation Hardening: No; RoHS Compliant: Yes; Voltage Rating (DC): 50V; Lead Free: Lead Free; Resistor Type: Ceramic; Height: 0.5mm; Dielectric: X7R; Thickness: 0.022inch; Case/Package: 0402; Case Code (Metric): 1005; Termination: SMD/SMT; Packaging: Tape and Reel; Max Operating Temperature: 125°C; Mount: Surface Mount; Package Quantity: 1; Width: 0.02inch; Weight: 2.3E-05oz; Voltage Rating: 50V; Tolerance: 10%; Construction: Flat; Case Code (Imperial): 0402; Length: 1mm; REACH SVHC: No SVHC; Series: C; Part Number: C1005X7R1H104K050BB
C153 C156 = C1608X5R0J226M080AC: as C152 on sheet SERIALIZER; Tolerance: ±20%; Series: C; Thickness (Max): 0.039"(1.00mm); Mounting Type: SurfaceMount,MLCC; Ratings: -; Datasheet Version: Mar-15; Package Reference: 603; Packaging: CutTape(CT); Features: -; Package / Case: 0603(1608Metric); Family: CeramicCapacitors; Lead Spacing: -; RoHS Information: RoHSCertificate-MLCC; Manufacturer URL: http://www.tdk.com/; Lead Style: -; Category: Capacitors; Applications: GeneralPurpose; Package Description: 2-Pin Surface Mount Device, Body 1.6 x 0.8 mm; Standard Package: 1; Datasheet URL: http://www.farnell.com/datasheets/1913358.pdf; Height - Seated (Max): -; Operating Temperature: -55degC~85degC; Size / Dimension: 0.063"Lx0.031"W(1.60mmx0.80mm)
L3 L4 = DFE252012P-4R7M=P2: Shielded Wirewound Inductor 4.7uH 20% 1400mA 0.2Ω 1008 (2520); Core Material: Ferrite; Test Frequency: 1MHz; DC Resistance (DCR): 200mR; Max DC Current: 1.4A; Current Rating: 2A; Case Code (Metric): 2520; Case Code (Imperial): 1008; Inductance: 4.7uH; Mount: Surface Mount; Packaging: Tape and Reel; Depth: 2mm; Length: 0.098inch; Case/Package: 1008; Max Operating Temperature: 125°C; Shielding: Shielded; Width: 0.079inch; Height - Seated (Max): 0.047inch; Tolerance: 20%; Min Operating Temperature: -40°C; Resistor Type: Wirewound
M1 = 1888247-1: SFP+, Connector, .8mm [.031in] Centerline, Power & Signal, Operating Temperature Range -55 – 85 °C [-67 – 185 °F], Data Rate (Max) 16Gb/sec; Manufacturer: TE Connectivity (TE; License: Apache-2.0; Author: Parsa Malekpor; Value: 1888247-1; Part Number: 1888247-1
Q4 = RU1J002YNTCL: MOSFET N-CH 50V 0.2A UMT3F; Manufacturer: Rohm; Drain To Source Resistance: 1.6Ω; Depletion Mode: False; Continuous Drain Current: 200mA; Pulse Drain Current: 800mA; Turn On Delay Time: 5ns; Threshold Vgs Max: 0.8V; Rthja Max: 833°C/W; Max Forward Diode Voltage: 1.2V; Max Junction Temp: +150°C; Standoff Height: 0mm; Input Capacitace At Vds: 26pF @ 10V; Number Of Channels: 1; Power Dissipation: 150mW; Gate To Source Voltage: 8V; Turn Off Delay Time: 17ns; Threshold Vgs Min: 0.3V; Lead Free: Yes; Device Class L3: MOSFETs; Drain To Source Voltage: 50V; ComponentLink2URL: https://d1d2qsbl8m0m72.cloudfront.net/en/products/databook/datasheet/discrete/transistor/mosfet/ru1j002yn-e.pdf; RoHS: TRUE; Device Class L2: Transistors; Mouser Description: MOSFET 0.9V Drive Nch MOSFET; Category: Trans; Octopart: https://octopart.com/ru1j002yntcl-rohm-47197697; Temperature: to +150°C; Height: 1.05mm; Number Of N Channels: 1; Package: UMT3F; ComponentLink2Description: Datasheet; Automotive: No; Drain To Source Breakdown Voltage: 50V; Device Class L1: Discrete Semiconductors; Digikey Description: MOSFET N-CH 50V 0.2A UMT3F; Manufacturer Part Number: RU1J002YNTCL; Temperature Range High: +150°C
R38 R81 R103 = RC0402FR-07100RL: Manufacturer: Yageo / Phycomp; Part Number: RC0402FR-07100RL
R82-R87 = RC0402FR-0710KL: Manufacturer: Yageo / Phycomp; Part Number: RC0402FR-0710KL
R89 R90 = ERJ-3RQFR33V: Manufacturer: Panasonic; Part Number: ERJ-3RQFR33V
SB4-SB6 = Solderbridge_1: Manufacturer: N.A.; Pad Count: 2; Part Number: Solderbridge; Manufacturer Part Number: N.A.; LatestRevisionDate: 2009-12-14; Published: 2009-12-14; Value: Solderbridge; Note: N.A.; Artikkelnr Noca: N.A.; Footprint Doc: Solderbridge; Part number IPS: N.A.; ComponentLink1URL: N.A.; ComponentLink1Description: Datasheet; ComponentLink2URL: N.A.; ComponentLink2Description: Supplier link; HelpURL: N.A.; Supplier 1: N.A.; Supplier Part Number 1: N.A.; Supplier 2: N.A.; Supplier Part Number 2: N.A.; Component Class: Connectors; PartId: 100500458

## Sheet FPGA PWR.SchDoc: XC7A3G-POWER
size A4; Date: 9 AUG 2026; Engineer: Parsa Malekpour; Revision: 1.0.0; SheetNumber: 8; SheetTotal: 18
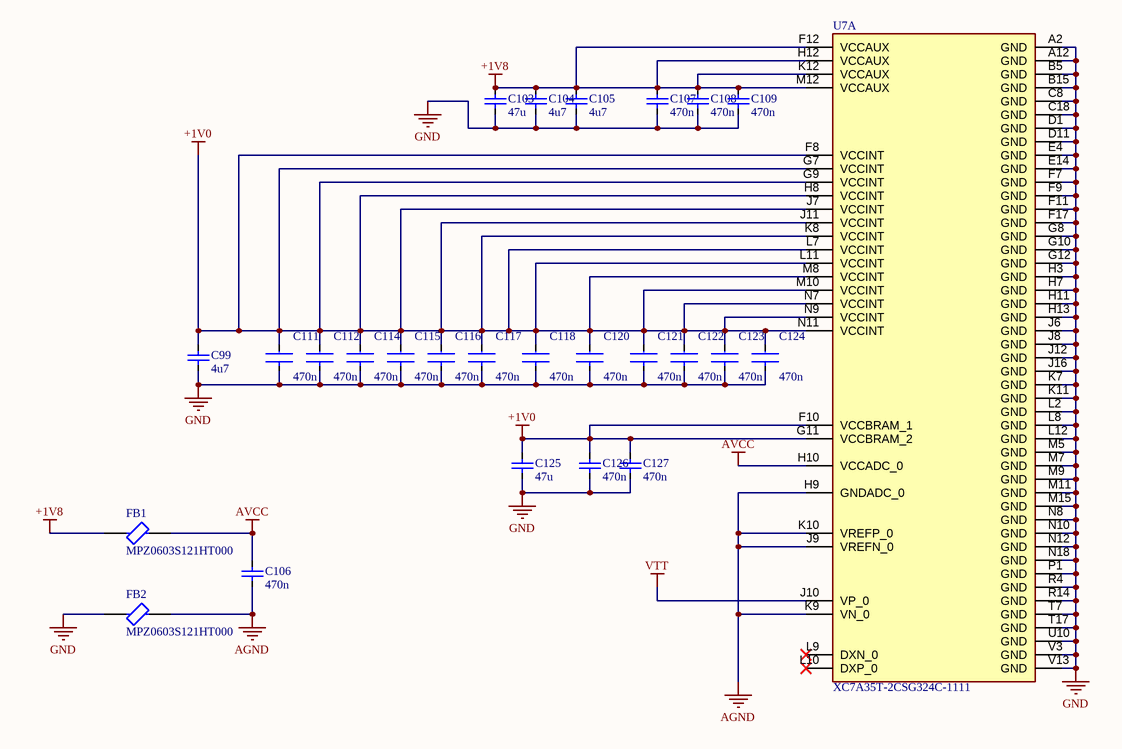
[diagram p12: FPGA PWR.SchDoc]

### Parts
C99  value 4u7  [FP-C1005-050-0_20-0_10-IPC_C]  (hidden comment: C1005X5R1A475K050BE)
C103  value 47u  [FP-C2012-125-0_2-IPC_C]  (hidden comment: C2012X5R1A476M125AC)
C104  value 4u7  [FP-C1005-050-0_20-0_10-IPC_C]  (hidden comment: C1005X5R1A475K050BE)
C105  value 4u7  [FP-C1005-050-0_20-0_10-IPC_C]  (hidden comment: C1005X5R1A475K050BE)
C106  value 470n  [FP-C1005-050-0_05-IPC_C]  (hidden comment: C1005X5R1E474K050BB)
C107  value 470n  [FP-C1005-050-0_05-IPC_C]  (hidden comment: C1005X5R1E474K050BB)
C108  value 470n  [FP-C1005-050-0_05-IPC_C]  (hidden comment: C1005X5R1E474K050BB)
C109  value 470n  [FP-C1005-050-0_05-IPC_C]  (hidden comment: C1005X5R1E474K050BB)
C111  value 470n  [FP-C1005-050-0_05-IPC_C]  (hidden comment: C1005X5R1E474K050BB)
C112  value 470n  [FP-C1005-050-0_05-IPC_C]  (hidden comment: C1005X5R1E474K050BB)
C114  value 470n  [FP-C1005-050-0_05-IPC_C]  (hidden comment: C1005X5R1E474K050BB)
C115  value 470n  [FP-C1005-050-0_05-IPC_C]  (hidden comment: C1005X5R1E474K050BB)
C116  value 470n  [FP-C1005-050-0_05-IPC_C]  (hidden comment: C1005X5R1E474K050BB)
C117  value 470n  [FP-C1005-050-0_05-IPC_C]  (hidden comment: C1005X5R1E474K050BB)
C118  value 470n  [FP-C1005-050-0_05-IPC_C]  (hidden comment: C1005X5R1E474K050BB)
C120  value 470n  [FP-C1005-050-0_05-IPC_C]  (hidden comment: C1005X5R1E474K050BB)
C121  value 470n  [FP-C1005-050-0_05-IPC_C]  (hidden comment: C1005X5R1E474K050BB)
C122  value 470n  [FP-C1005-050-0_05-IPC_C]  (hidden comment: C1005X5R1E474K050BB)
C123  value 470n  [FP-C1005-050-0_05-IPC_C]  (hidden comment: C1005X5R1E474K050BB)
C124  value 470n  [FP-C1005-050-0_05-IPC_C]  (hidden comment: C1005X5R1E474K050BB)
C125  value 47u  [FP-C2012-125-0_2-IPC_C]  (hidden comment: C2012X5R1A476M125AC)
C126  value 470n  [FP-C1005-050-0_05-IPC_C]  (hidden comment: C1005X5R1E474K050BB)
C127  value 470n  [FP-C1005-050-0_05-IPC_C]  (hidden comment: C1005X5R1E474K050BB)
FB1  MPZ0603S121HT000  [FP-MPZ0603-IPC_C]
FB2  MPZ0603S121HT000  [FP-MPZ0603-IPC_C]
U7  XC7A35T-2CSG324C-1111  [BGA324C80P18X18_1500X1500X150]  (part A of 8)

### Nets
+1V0: C99.1 C111.2 C112.2 C114.2 C115.2 C116.2 C117.2 C118.2 C120.2 C121.2 C122.2 C123.2 C124.2 C125.1 C126.1 C127.1 U7.F8(VCCINT) U7.F10(VCCBRAM_1) U7.G7(VCCINT) U7.G9(VCCINT) U7.G11(VCCBRAM_2) U7.H8(VCCINT) U7.J7(VCCINT) U7.J11(VCCINT) U7.K8(VCCINT) U7.L7(VCCINT) U7.L11(VCCINT) U7.M8(VCCINT) U7.M10(VCCINT) U7.N7(VCCINT) U7.N9(VCCINT) U7.N11(VCCINT)
+1V8: C103.1 C104.1 C105.1 C107.1 C108.1 C109.1 FB1.1 U7.F12(VCCAUX) U7.H12(VCCAUX) U7.K12(VCCAUX) U7.M12(VCCAUX)
AGND: C106.2 FB2.2 U7.H9(GNDADC_0) U7.J9(VREFN_0) U7.K9(VN_0) U7.K10(VREFP_0)
AVCC: C106.1 FB1.2 U7.H10(VCCADC_0)
GND: C99.2 C103.2 C104.2 C105.2 C107.2 C108.2 C109.2 C111.1 C112.1 C114.1 C115.1 C116.1 C117.1 C118.1 C120.1 C121.1 C122.1 C123.1 C124.1 C125.2 C126.2 C127.2 FB2.1 U7.A2(GND) U7.A12(GND) U7.B5(GND) U7.B15(GND) U7.C8(GND) U7.C18(GND) U7.D1(GND) U7.D11(GND) U7.E4(GND) U7.E14(GND) U7.F7(GND) U7.F9(GND) U7.F11(GND) U7.F17(GND) U7.G8(GND) U7.G10(GND) U7.G12(GND) U7.H3(GND) U7.H7(GND) U7.H11(GND) U7.H13(GND) U7.J6(GND) U7.J8(GND) U7.J12(GND) U7.J16(GND) U7.K7(GND) U7.K11(GND) U7.L2(GND) U7.L8(GND) U7.L12(GND) U7.M5(GND) U7.M7(GND) U7.M9(GND) U7.M11(GND) U7.M15(GND) U7.N8(GND) U7.N10(GND) U7.N12(GND) U7.N18(GND) U7.P1(GND) U7.R4(GND) U7.R14(GND) U7.T7(GND) U7.T17(GND) U7.U10(GND) U7.V3(GND) U7.V13(GND)
VTT: U7.J10(VP_0)

Not connected (* = marked no-connect by the designer): U7 L9(DXN_0)* L10(DXP_0)*

### Notes on the sheet
- TITLE
- REV
- Date
- A4
- FILE NAME
- CODE
- SHEET
- Engineer
- OF

### Library data of the parts
C99 = C1005X5R1A475K050BE: 4.7UF 10V X5R 0402; Tolerance: 10%; Max Operating Temperature: 85°C; Case Code (Metric): 1005; Voltage Rating: 10V; Packaging: Tape and Reel; Case/Package: 0402; Features: Soft Termination; Min Operating Temperature: -55°C; Mount: Surface Mount; Case Code (Imperial): 0402; RoHS Compliant: Yes; Part Number: C1005X5R1A475K050BE
C103 C125 = C2012X5R1A476M125AC: MLCC 47μF ±20% 10V X5R SMD 0805 Multilayer Ceramic Capacitors; RoHS Compliant: Yes; Dielectric: X5R; Case Code (Imperial): 0805; Min Operating Temperature: -55°C; Length: 2mm; Voltage Rating: 10V; Lead Free: Lead Free; Weight: 0.000194oz; Resistor Type: Ceramic; Dielectric Material: Ceramic; Max Operating Temperature: 85°C; Height: 1.25mm; Width: 0.049inch; Depth: 1.25mm; Termination: SMD/SMT; Case/Package: 0805; Voltage Rating (DC): 10V; Voltage: 10V; Thickness: 0.057inch; Tolerance: 20%; REACH SVHC: No SVHC; Package Quantity: 1; Series: C; Case Code (Metric): 2012; Mount: Surface Mount; Packaging: Tape and Reel; Part Number: C2012X5R1A476M125AC
C104 C105 = C1005X5R1A475K050BE: as C140 on sheet OPTICS; Max Operating Temperature: 85°C; Case Code (Metric): 1005; Voltage Rating: 10V; Packaging: Tape and Reel; Case/Package: 0402; Features: Soft Termination; Min Operating Temperature: -55°C; Mount: Surface Mount; Case Code (Imperial): 0402; RoHS Compliant: Yes; Part Number: C1005X5R1A475K050BE
C106-C109 C126 C127 = C1005X5R1E474K050BB: MLCC 470nF ±10% 25V X5R SMD 0402; Dielectric Material: Ceramic; Dissipation Factor: 10%; Case Code (Metric): 1005; RoHS Compliant: Yes; Lead Free: Lead Free; Length: 1mm; Case/Package: 0402; Termination: SMD/SMT; Dielectric: X5R; Depth: 0.5mm; Series: C; Voltage: 25V; Tolerance: 10%; Packaging: Tape and Reel; Resistor Type: Ceramic; Min Operating Temperature: -55°C; Width: 0.02inch; Thickness: 500um; Package Quantity: 10000; Case Code (Imperial): 0402; Construction: Flat; Height: 0.5mm; REACH SVHC: No SVHC; Radiation Hardening: No; Weight: 2.3E-05oz; Mount: Surface Mount; Voltage Rating (DC): 25V; Max Operating Temperature: 85°C; Part Number: C1005X5R1E474K050BB; Voltage Rating: 25V
C111 C112 C114-C118 C120-C124 = CMP-2000-06003-2: Multilayer Ceramic Capacitors 470nF ±10% 25V X5R SMD 0402; Dissipation Factor: 10%; Case Code (Metric): 1005; RoHS Compliant: Yes; Lead Free: Lead Free; Length: 1mm; Case/Package: 0402; Termination: SMD/SMT; Voltage Rating: 25V; Dielectric Material: Ceramic; Dielectric: X5R; Depth: 0.5mm; Series: C; Voltage: 25V; Tolerance: 10%; Packaging: Tape and Reel; Resistor Type: Ceramic; Min Operating Temperature: -55°C; Width: 0.02inch; Thickness: 500um; Package Quantity: 10000; Case Code (Imperial): 0402; Construction: Flat; Height: 0.5mm; REACH SVHC: No SVHC; Radiation Hardening: No; Weight: 2.3E-05oz; Mount: Surface Mount; Voltage Rating (DC): 25V; Max Operating Temperature: 85°C; Part Number: C1005X5R1E474K050BB
FB1 FB2 = MPZ0603S121HT000: CHIP BEADS FOR GENERAL SIGNAL LI; Max Current Rating: 1A; DC Resistance (DCR): 130mR; Number of Lines: 1; Min Operating Temperature: -55°C; Mount: Surface Mount; Case Code (Imperial): 0201; Case Code (Metric): 0603; Max Operating Temperature: 125°C; RoHS Compliant: Yes; Packaging: Cut Tape; Case/Package: 0201
U7 = XC7A35T-2CSG324C-1111: Integrated Circuit; Manufacturer_Name: AMD; Datasheet Link: https://www.xilinx.com/support/documentation/data_sheets/ds181_Artix_7_Data_Sheet.pdf; Height: 1.5mm; Manufacturer_Part_Number: XC7A35T-2CSG324C; Mouser Part Number: 217-XC7A35T-2CSG324C; Mouser Price/Stock: https://www.mouser.co.uk/ProductDetail/AMD-Xilinx/XC7A35T-2CSG324C?qs=rrS6PyfT74fMA9%2F3WtPZmw%3D%3D

## Sheet FPGA CONFIG.SchDoc: XC7A3G-JTAG
size A4; Date: 9 AUG 2026; Engineer: Parsa Malekpour; Revision: 1.0.0; SheetNumber: 7; SheetTotal: 18
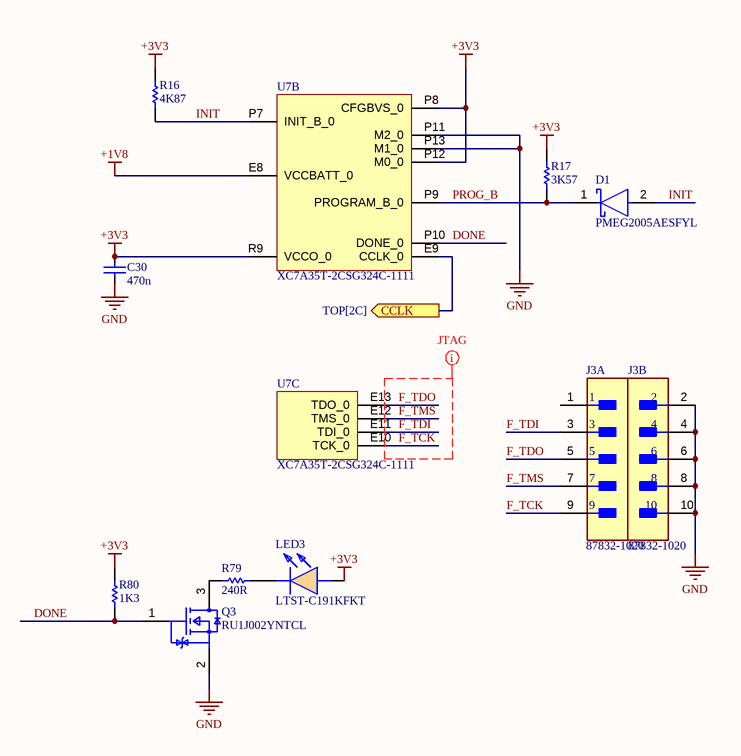
[diagram p13: FPGA CONFIG.SchDoc]

### Parts
C30  value 470n  [FP-C1005-050-0_05-IPC_C]  (hidden comment: C1005X5R1E474K050BB)
D1  PMEG2005AESFYL  [FP-PMEG2005AESFYL-MFG]
J3  87832-1020  [FP-87832-1020-MFG]  (parts A,B of 2)
LED3  LTST-C191KFKT  [LEDC1608X55N]
Q3  RU1J002YNTCL  [FP-UMT3F-MFG]
R16  value 4K87  [RESC1005X40X25LL05T10]  (hidden comment: RC0402FR-074K87L)
R17  value 3K57  [RESC1005X40X25LL05T10]  (hidden comment: RC0402FR-073K57L)
R79  value 240R  [RESC1005X40X25LL05T10]  (hidden comment: RC0402FR-07240RL)
R80  value 1K3  [RESC1005X40X25LL05T10]  (hidden comment: RC0402FR-071K3L)
U7  XC7A35T-2CSG324C-1111  [BGA324C80P18X18_1500X1500X150]  (parts B,C of 8)

### Ports
CCLK (out, see TOP[2C])

### Nets
+1V8: U7.E8(VCCBATT_0)
+3V3: C30.1 LED3.2(A) R16.2 R17.1 R80.2 U7.P8(CFGBVS_0) U7.P12(M0_0) U7.R9(VCCO_0)
GND: C30.2 J3.2 J3.4 J3.6 J3.8 J3.10 Q3.2(S) U7.P11(M2_0) U7.P13(M1_0)
DONE: Q3.1(G) R80.1 U7.P10(DONE_0)
F_TCK: J3.9 U7.E10(TCK_0)
F_TDI: J3.3 U7.E11(TDI_0)
F_TDO: J3.5 U7.E13(TDO_0)
F_TMS: J3.7 U7.E12(TMS_0)
INIT: D1.2(A) R16.1 U7.P7(INIT_B_0)
PROG_B: D1.1(K) R17.2 U7.P9(PROGRAM_B_0)
SPI_SCK: U7.E9(CCLK_0) ; port CCLK
NetLED3_1: LED3.1(K) R79.2
NetQ3_3: Q3.3(D) R79.1

Not connected (* = marked no-connect by the designer): J3 1

### Layout directives
net class JTAG; rule Impedance Constraint [Min = 45.00    Max = 55.00    ]: F_TCK, F_TDI, F_TDO, F_TMS

### Notes on the sheet
- TITLE
- REV
- Date
- A4
- FILE NAME
- CODE
- SHEET
- Engineer
- OF

### Library data of the parts
C30 = C1005X5R1E474K050BB: Multilayer Ceramic Capacitors 470nF ±10% 25V X5R SMD 0402; Dissipation Factor: 10%; Case Code (Metric): 1005; RoHS Compliant: Yes; Lead Free: Lead Free; Length: 1mm; Case/Package: 0402; Termination: SMD/SMT; Dielectric Material: Ceramic; Dielectric: X5R; Depth: 0.5mm; Series: C; Voltage: 25V; Tolerance: 10%; Packaging: Tape and Reel; Resistor Type: Ceramic; Min Operating Temperature: -55°C; Width: 0.02inch; Thickness: 500um; Package Quantity: 10000; Case Code (Imperial): 0402; Construction: Flat; Height: 0.5mm; REACH SVHC: No SVHC; Radiation Hardening: No; Weight: 2.3E-05oz; Mount: Surface Mount; Voltage Rating (DC): 25V; Max Operating Temperature: 85°C; Part Number: C1005X5R1E474K050BB; Voltage Rating: 25V
D1 = PMEG2005AESFYL: DIODE SCHOTTKY 20V 0.5A SOD962; Manufacturer: Nexperia; Max Junction Temp: +150°C; Peak Reverse Current: 10uA; Capacitance: 25pF; Forward Current: 0.71A; Max Surge Forward Current: 4.5A; Value: 25pF; Lead Free: Yes; ComponentLink2Description: Datasheet; Octopart: https://octopart.com/pmeg2005aesfyl-nexperia-78741393; Ambient Temperature Range High: +150°C; Height: 0.32mm; Footprint Url: https://assets.nexperia.com/documents/outline-drawing/SOD962-2.pdf; Automotive: No; Device Class L2: Diodes; Ambient Temperature Range Low: -55°C; Device Class L3: Schottky Diodes; ComponentLink2URL: https://assets.nexperia.com/documents/data-sheet/PMEG2005AESF.pdf; Reverse Voltage: 20V; Temperature: to +150°C; Temperature Range High: +150°C; Device Class L1: Discrete Semiconductors; RoHS: TRUE; Digikey Description: DIODE SCHOTTKY 20V 0.5A SOD962; Category: Diode; Package: SOD962; Manufacturer Part Number: PMEG2005AESFYL
J3 = CMP-04776-000811-1: CONN HEADER SMD 10POS 2MM; Number of Positions: 10; Current Rating: 2A; Connector Type: Male Pin; Voltage Rating: 125V; Gender: Male; Row Spacing: 0.079inch; Contact Mating Length: 0.141inch; Contact Type: Male Pin; Series: Milli-Grid™ 87832; RoHS Compliant: Yes; Depth: 6.35mm; Orientation: Straight; Contact Material: Bronze; Mount: Surface Mount; Min Operating Temperature: -55°C; Housing Color: Black; Pitch: 2mm; Length: 12.65mm; Housing Material: Nylon; Packaging: Rail/Tube; Termination: Solder; Max Operating Temperature: 105°C; Contact Plating: Gold; Number of Rows: 2; Color: Black; Number of Contacts: 10
LED3 = LTST-C191KFKT: LED; Manufacturer: Lite-On; Value: Orange; Datasheet Link: https://datasheet.datasheetarchive.com/originals/distributors/Datasheets-305/79307.pdf; Height: 0.55mm; Mouser Part Number: 859-LTST-C191KFKT; Mouser Price/Stock: https://www.mouser.co.uk/ProductDetail/Lite-On/LTST-C191KFKT?qs=1bx9pL%2Fk%252BiAv01YAc0eitQ%3D%3D; Arrow Part Number: LTST-C191KFKT; Arrow Price/Stock: https://www.arrow.com/en/products/ltst-c191kfkt/lite-on-technology.html?utm_currency=USD&region=nac; Part Number: LTST-C191KFKT
Q3 = RU1J002YNTCL: as Q4 on sheet OPTICS; Lead Free: Yes; Device Class L3: MOSFETs; Drain To Source Voltage: 50V; ComponentLink2URL: https://d1d2qsbl8m0m72.cloudfront.net/en/products/databook/datasheet/discrete/transistor/mosfet/ru1j002yn-e.pdf; RoHS: TRUE; Device Class L2: Transistors; Mouser Description: MOSFET 0.9V Drive Nch MOSFET; Category: Trans; Octopart: https://octopart.com/ru1j002yntcl-rohm-47197697; Temperature: to +150°C; Height: 1.05mm; Number Of N Channels: 1; Package: UMT3F; ComponentLink2Description: Datasheet; Automotive: No; Drain To Source Breakdown Voltage: 50V; Device Class L1: Discrete Semiconductors; Digikey Description: MOSFET N-CH 50V 0.2A UMT3F; Manufacturer Part Number: RU1J002YNTCL; Temperature Range High: +150°C
R16 = RC0402FR-074K87L: Manufacturer: Yageo / Phycomp; Part Number: RC0402FR-074K87L
R17 = RC0402FR-073K57L: Manufacturer: Yageo; Part Number: RC0402FR-073K57L; Parameter 1: *
R79 = RC0402FR-07240RL: 240R 0.063W 1% 0402 (1005 Metric)  SMD; Case-Metric: 1005; Case-EIA: 0402; Power: 0.063 W; Tolerance: 1 %; Technology: SMT; Part Number: RC0402FR-07240RL; Parameter 1: *
R80 = RC0402FR-071K3L: Manufacturer: Yageo / Phycomp; Part Number: RC0402FR-071K3L
U7 = XC7A35T-2CSG324C-1111: as U7 on sheet FPGA PWR; Datasheet Link: https://www.xilinx.com/support/documentation/data_sheets/ds181_Artix_7_Data_Sheet.pdf; Height: 1.5mm; Manufacturer_Part_Number: XC7A35T-2CSG324C; Mouser Part Number: 217-XC7A35T-2CSG324C; Mouser Price/Stock: https://www.mouser.co.uk/ProductDetail/AMD-Xilinx/XC7A35T-2CSG324C?qs=rrS6PyfT74fMA9%2F3WtPZmw%3D%3D

## Sheet FLASH.SchDoc: XC7A3G-FLASH
size A4; Date: 9 AUG 2026; Engineer: Parsa Malekpour; Revision: 1.0.0; SheetNumber: 16; SheetTotal: 18
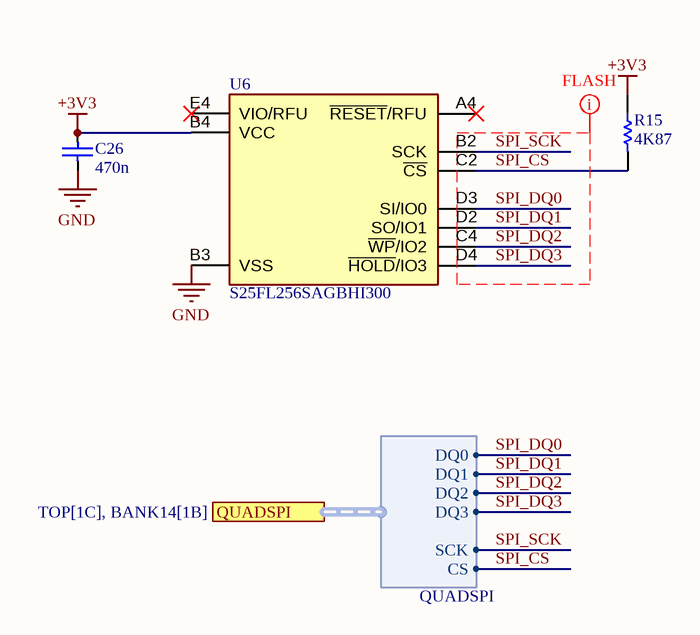
[diagram p14: FLASH.SchDoc]

### Parts
C26  value 470n  [FP-C1005-050-0_05-IPC_C]  (hidden comment: C1005X5R1E474K050BB)
R15  value 4K87  [RESC1005X40X25LL05T10]  (hidden comment: RC0402FR-074K87L)
U6  S25FL256SAGBHI300  [BGA24C100P4X6_600X800X120]

### Ports
QUADSPI (harness QUADSPI, see TOP[1C], BANK14[1B])

### Harnesses
QUADSPI: DQ0, DQ1, DQ2, DQ3, SCK, CS

### Nets
+3V3: C26.1 R15.1 U6.B4(VCC)
GND: C26.2 U6.B3(VSS)
SPI_CS: R15.2 U6.C2(~{CS}) ; port QUADSPI.CS
SPI_DQ0: U6.D3(SI/IO0) ; port QUADSPI.DQ0
SPI_DQ1: U6.D2(SO/IO1) ; port QUADSPI.DQ1
SPI_DQ2: U6.C4(~{WP}/IO2) ; port QUADSPI.DQ2
SPI_DQ3: U6.D4(~{HOLD}/IO3) ; port QUADSPI.DQ3
SPI_SCK: U6.B2(SCK) ; port QUADSPI.SCK

Not connected (* = marked no-connect by the designer): U6 A1(NC_1) A2(NC_2) A3(NC_3) A4(~{RESET}/RFU)* B1(DNU_1) C1(DNU_2) C3(RFU) D1(DNU_3) E1(NC_4) E2(NC_5) E3(NC_6) E4(VIO/RFU)* F1(NC_7) F2(NC_8) F3(NC_9) F4(NC_10)

### Layout directives
net class FLASH; rule Matched Net Lengths [Delay Tolerance = 100ps]: SPI_CS, SPI_DQ0, SPI_DQ1, SPI_DQ2, SPI_DQ3, SPI_SCK

### Notes on the sheet
- TITLE
- REV
- Date
- A4
- FILE NAME
- CODE
- SHEET
- Engineer
- OF

### Library data of the parts
C26 = C1005X5R1E474K050BB: as C106-C109 on sheet FPGA PWR; Dissipation Factor: 10%; Case Code (Metric): 1005; RoHS Compliant: Yes; Lead Free: Lead Free; Length: 1mm; Case/Package: 0402; Termination: SMD/SMT; Dielectric: X5R; Depth: 0.5mm; Series: C; Voltage: 25V; Tolerance: 10%; Packaging: Tape and Reel; Resistor Type: Ceramic; Min Operating Temperature: -55°C; Width: 0.02inch; Thickness: 500um; Package Quantity: 10000; Case Code (Imperial): 0402; Construction: Flat; Height: 0.5mm; REACH SVHC: No SVHC; Radiation Hardening: No; Weight: 2.3E-05oz; Mount: Surface Mount; Voltage Rating (DC): 25V; Max Operating Temperature: 85°C; Part Number: C1005X5R1E474K050BB; Voltage Rating: 25V
R15 = RC0402FR-074K87L: Manufacturer: Yageo / Phycomp; Part Number: RC0402FR-074K87L
U6 = S25FL256SAGBHI200: Integrated Circuit; Manufacturer_Name: Infineon; Datasheet Link: https://www.cypress.com/file/448601/download; Height: 1.2mm; Manufacturer_Part_Number: S25FL256SAGBHI300; Mouser Part Number: 797-25FL256SAGBHI300; Mouser Price/Stock: https://www.mouser.co.uk/ProductDetail/Infineon-Technologies/S25FL256SAGBHI200?qs=%252B97ACBfLqz%2F7D9cRggMsKA%3D%3D; Arrow Part Number: S25FL256SAGBHI300; Arrow Price/Stock: https://www.arrow.com/en/products/s25fl256sagbhi200/infineon-technologies-ag?utm_currency=USD&region=nac